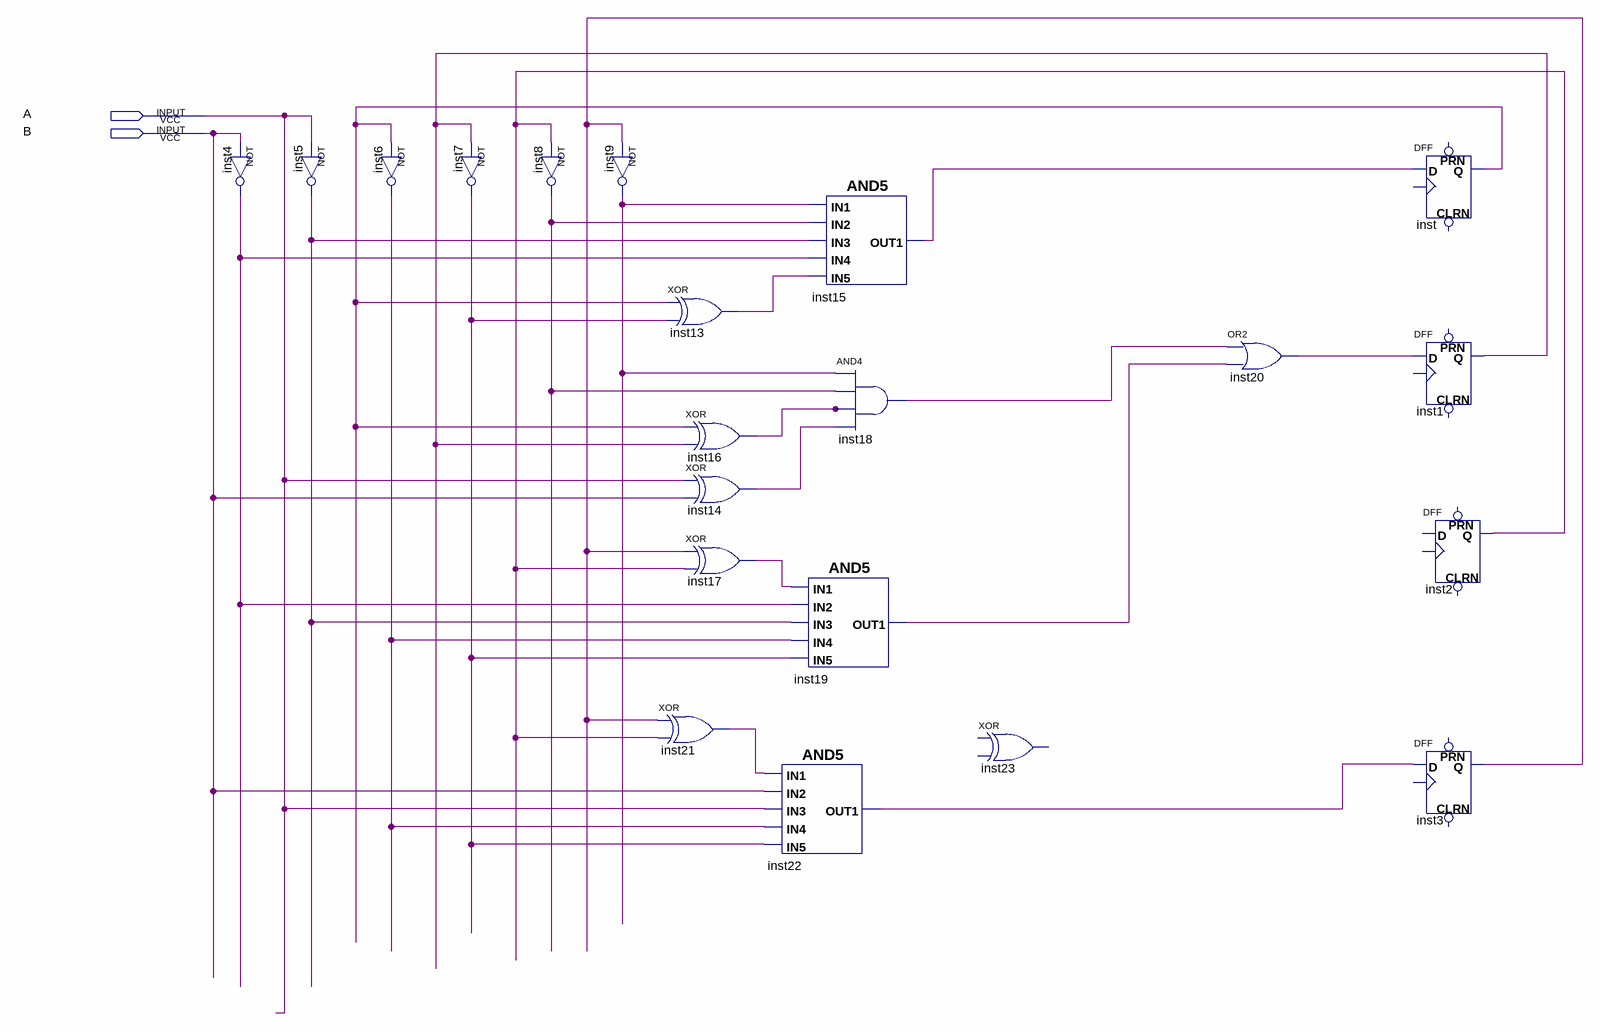
[diagram p0: schematic sheet]
// Quartus schematic Problem7.bdf as structural Verilog: 21 symbols, 2 pins
module Problem7 (
  input  A,
  input  B
);

  wire inst1_q, inst2_q, inst3_q, inst4_out, inst5_out, inst6_out, inst7_out, inst8_out, inst9_out,
       inst13_out, inst14_out, inst15_out1, inst16_out, inst17_out, inst18_out, inst19_out1, inst20_out,
       inst21_out, inst22_out1, inst_q;

  not inst4 (inst4_out, B);
  not inst5 (inst5_out, A);
  not inst6 (inst6_out, inst_q);
  not inst7 (inst7_out, inst1_q);
  not inst8 (inst8_out, inst2_q);
  not inst9 (inst9_out, inst3_q);
  xor inst13 (inst13_out, inst_q, inst7_out);
  xor inst16 (inst16_out, inst_q, inst1_q);
  xor inst14 (inst14_out, A, B);
  xor inst17 (inst17_out, inst3_q, inst2_q);
  xor inst21 (inst21_out, inst3_q, inst2_q);
  AND5 inst22 (.IN3(A), .IN2(B), .IN1(inst21_out), .IN5(inst7_out), .IN4(inst6_out), .OUT1(inst22_out1));
  AND5 inst15 (
    .IN3(inst5_out), .IN2(inst8_out), .IN1(inst9_out), .IN5(inst13_out), .IN4(inst4_out), .OUT1(inst15_out1));
  and inst18 (inst18_out, inst9_out, inst8_out, inst16_out, inst14_out);
  AND5 inst19 (
    .IN3(inst5_out), .IN2(inst4_out), .IN1(inst17_out), .IN5(inst7_out), .IN4(inst6_out), .OUT1(inst19_out1));
  // XOR inst23 is placed but not wired
  or inst20 (inst20_out, inst18_out, inst19_out1);
  DFF inst (.D(inst15_out1), .Q(inst_q));  // open: CLRN, CLK, PRN
  DFF inst1 (.D(inst20_out), .Q(inst1_q));  // open: CLRN, CLK, PRN
  DFF inst2 (.Q(inst2_q));  // open: CLRN, CLK, D, PRN
  DFF inst3 (.D(inst22_out1), .Q(inst3_q));  // open: CLRN, CLK, PRN
endmodule
